# Altium schematic sheet ADC.SchDoc
size Tabloid; DocumentNumber: 6; SheetNumber: 6; SheetTotal: 11; SheetName: ADC; Size: 11x17; Sheet_Name: ADC
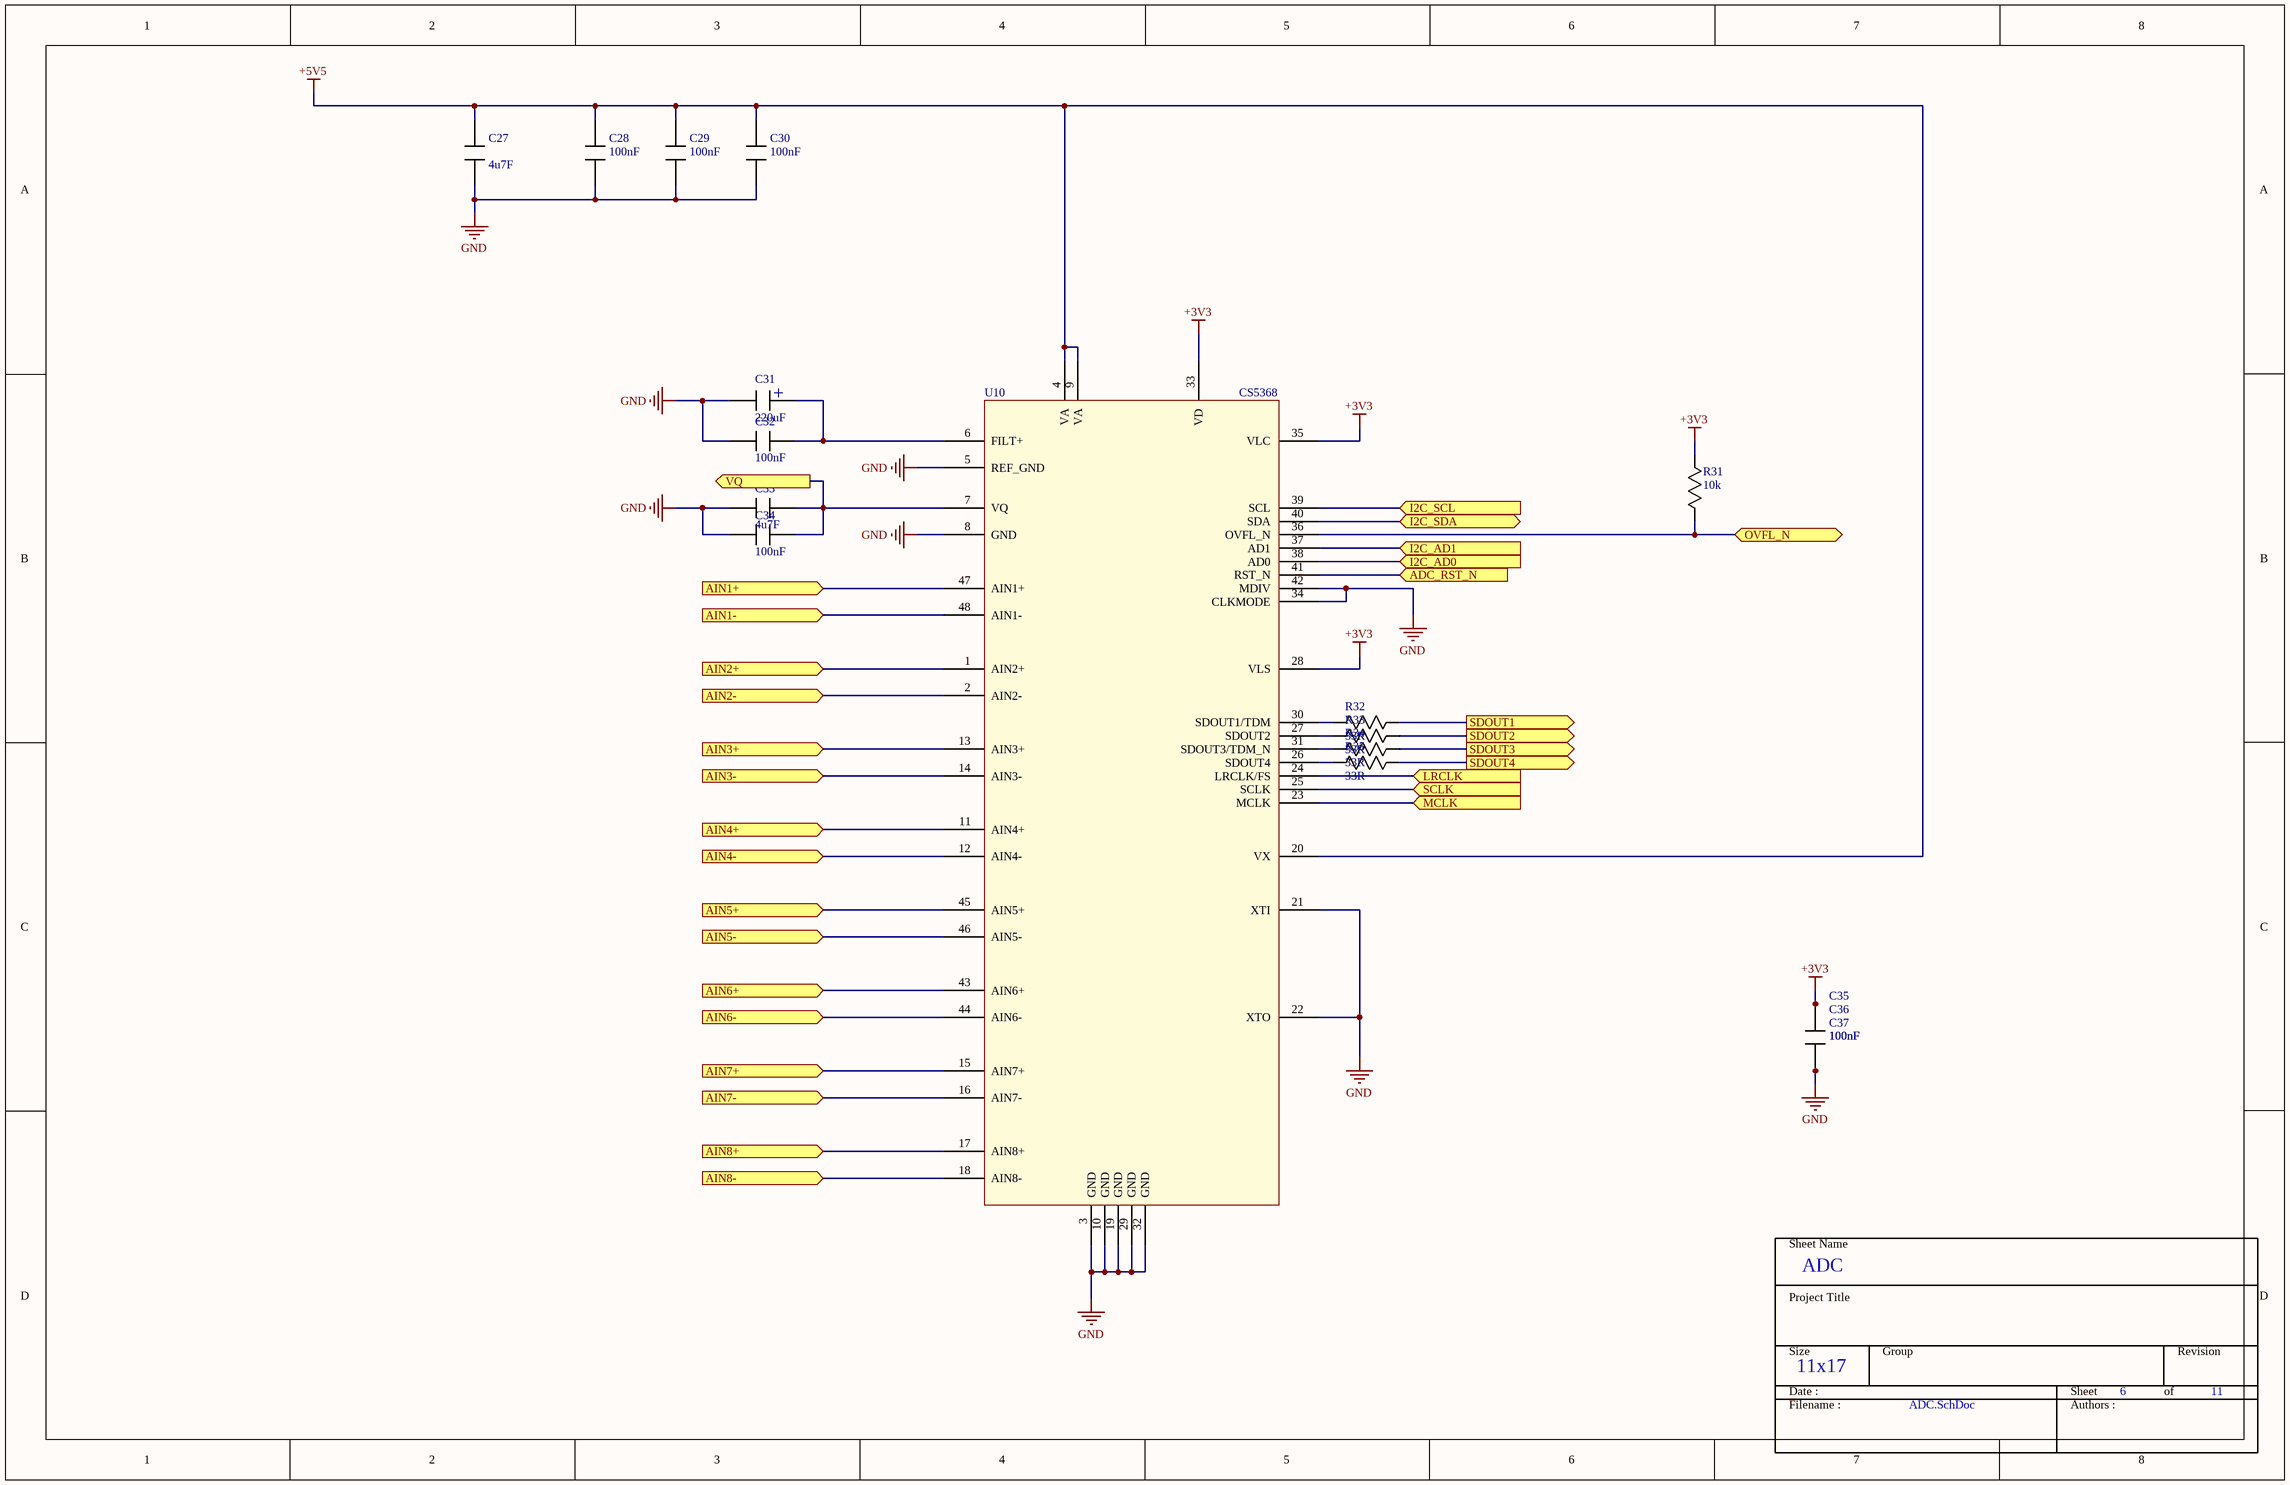
[diagram p0: ADC.SchDoc]

## Parts
C27  value 4u7F  [0805]  (hidden comment: Capacitor)
C28  value 100nF  [0603]  (hidden comment: Capacitor)
C29  value 100nF  [0603]  (hidden comment: Capacitor)
C30  value 100nF  [0603]  (hidden comment: Capacitor)
C31  value 220uF  [CAP_RAD_SMD_DIA315]  (hidden comment: Capacitor_Polarized_1)
C32  value 100nF  [0603]  (hidden comment: Capacitor)
C33  value 4u7F  [0805]  (hidden comment: Capacitor)
C34  value 100nF  [0603]  (hidden comment: Capacitor)
C35  value 100nF  [0603]  (hidden comment: Capacitor)
C36  value 100nF  [0603]  (hidden comment: Capacitor)
C37  value 100nF  [0603]  (hidden comment: Capacitor)
R31  value 10k  [0603]  (hidden comment: Resistor)
R32  value 33R  [0603]  (hidden comment: Resistor)
R33  value 33R  [0603]  (hidden comment: Resistor)
R34  value 33R  [0603]  (hidden comment: Resistor)
R35  value 33R  [0603]  (hidden comment: Resistor)
U10  CS5368  [LQFP_48L_CIRRUS]

## Ports
ADC_RST_N (in), AIN1+ (in), AIN1- (in), AIN2+ (in), AIN2- (in), AIN3+ (in), AIN3- (in), AIN4+ (in), AIN4- (in), AIN5+ (in), AIN5- (in), AIN6+ (in), AIN6- (in), AIN7+ (in), AIN7- (in), AIN8+ (in), AIN8- (in), I2C_AD0 (in), I2C_AD1 (in), I2C_SCL (in), I2C_SDA (bidir), LRCLK (in), MCLK (in), OVFL_N (bidir), SCLK (in), SDOUT1 (out), SDOUT2 (out), SDOUT3 (out), SDOUT4 (out), VQ (out)

## Nets
+3V3: C35.1 C36.1 C37.1 R31.1 U10.28(VLS) U10.33(VD) U10.35(VLC)
+5V5: C27.1 C28.1 C29.1 C30.1 U10.4(VA) U10.9(VA) U10.20(VX)
GND: C27.2 C28.2 C29.2 C30.2 C31.- C32.2 C33.2 C34.2 C35.2 C36.2 C37.2 U10.3(GND) U10.5(REF_GND) U10.8(GND) U10.10(GND) U10.19(GND) U10.21(XTI) U10.22(XTO) U10.29(GND) U10.32(GND) U10.34(CLKMODE) U10.42(MDIV)
ADC_RST_N: U10.41(RST_N) ; port ADC_RST_N
AIN1+: U10.47(AIN1+) ; port AIN1+
AIN1-: U10.48(AIN1-) ; port AIN1-
AIN2+: U10.1(AIN2+) ; port AIN2+
AIN2-: U10.2(AIN2-) ; port AIN2-
AIN3+: U10.13(AIN3+) ; port AIN3+
AIN3-: U10.14(AIN3-) ; port AIN3-
AIN4+: U10.11(AIN4+) ; port AIN4+
AIN4-: U10.12(AIN4-) ; port AIN4-
AIN5+: U10.45(AIN5+) ; port AIN5+
AIN5-: U10.46(AIN5-) ; port AIN5-
AIN6+: U10.43(AIN6+) ; port AIN6+
AIN6-: U10.44(AIN6-) ; port AIN6-
AIN7+: U10.15(AIN7+) ; port AIN7+
AIN7-: U10.16(AIN7-) ; port AIN7-
AIN8+: U10.17(AIN8+) ; port AIN8+
AIN8-: U10.18(AIN8-) ; port AIN8-
I2C_AD0: U10.38(AD0) ; port I2C_AD0
I2C_AD1: U10.37(AD1) ; port I2C_AD1
I2C_SCL: U10.39(SCL) ; port I2C_SCL
I2C_SDA: U10.40(SDA) ; port I2C_SDA
LRCLK: U10.24(LRCLK/FS) ; port LRCLK
MCLK: U10.23(MCLK) ; port MCLK
OVFL_N: R31.2 U10.36(OVFL_N) ; port OVFL_N
SCLK: U10.25(SCLK) ; port SCLK
SDOUT1: R32.2 ; port SDOUT1
SDOUT2: R33.2 ; port SDOUT2
SDOUT3: R34.2 ; port SDOUT3
SDOUT4: R35.2 ; port SDOUT4
VQ: C33.1 C34.1 U10.7(VQ) ; port VQ
NetC31_+: C31.+ C32.1 U10.6(FILT+)
NetR32_1: R32.1 U10.30(SDOUT1/TDM)
NetR33_1: R33.1 U10.27(SDOUT2)
NetR34_1: R34.1 U10.31(SDOUT3/TDM_N)
NetR35_1: R35.1 U10.26(SDOUT4)

## Notes on the sheet
- Sheet Name
- Project Title
- Size
- Group
- Revision
- Date :
- Filename :
- Sheet
- Authors :
- of

## Library data of the parts
C27 C33 = Capacitor: Mfg: Samsung; Mfg_PN: CL21A475KAQNNNG; HelpURL: *; NI: *; Supplier1: Digikey; Supplier1_PN: 1276-6462-1-ND; Tolerance: *; Type: *; Rating: *
C28-C30 C32 C34-C37 = Capacitor: Mfg: Samsung; Mfg_PN: CL10F104ZO8NNNC; HelpURL: *; NI: *; Supplier1: Digikey; Supplier1_PN: 1276-1258-1-ND; Tolerance: *; Type: *; Rating: *
C31 = Capacitor_Polarized_1: Capacitor; Mfg: Nichicon; Mfg_PN: UWT1E221MNL1GS; HelpURL: *; NI: *; Supplier1: Digikey; Supplier1_PN: 493-2192-1-ND; Tolerance: *; Type: *; Rating: *
R31 = Resistor: Mfg: Yageo; Mfg_PN: RC0603JR-0710KL; HelpURL: *; NI: *; Supplier1: Digikey; Supplier1_PN: 311-10KGRCT-ND; Type: *; Rating: *; Tolerance: *
R32-R35 = Resistor: Mfg: Yageo; Mfg_PN: RC0603JR-0733RL; HelpURL: *; NI: *; Supplier1: Digikey; Supplier1_PN: 311-33GRCT-ND; Type: *; Rating: *; Tolerance: *
U10 = CS5368: ADC, 24bit, 8 chan, 192kHz, PCM, TDM, LQFP48; Mfg_PN: CS5368-CQZ; Mfg: Cirrus; Supplier1: Digikey; Supplier1_PN: 598-1090-ND